# EAGLE design InterfaceBoardRevD (EAGLE 7.5.0)
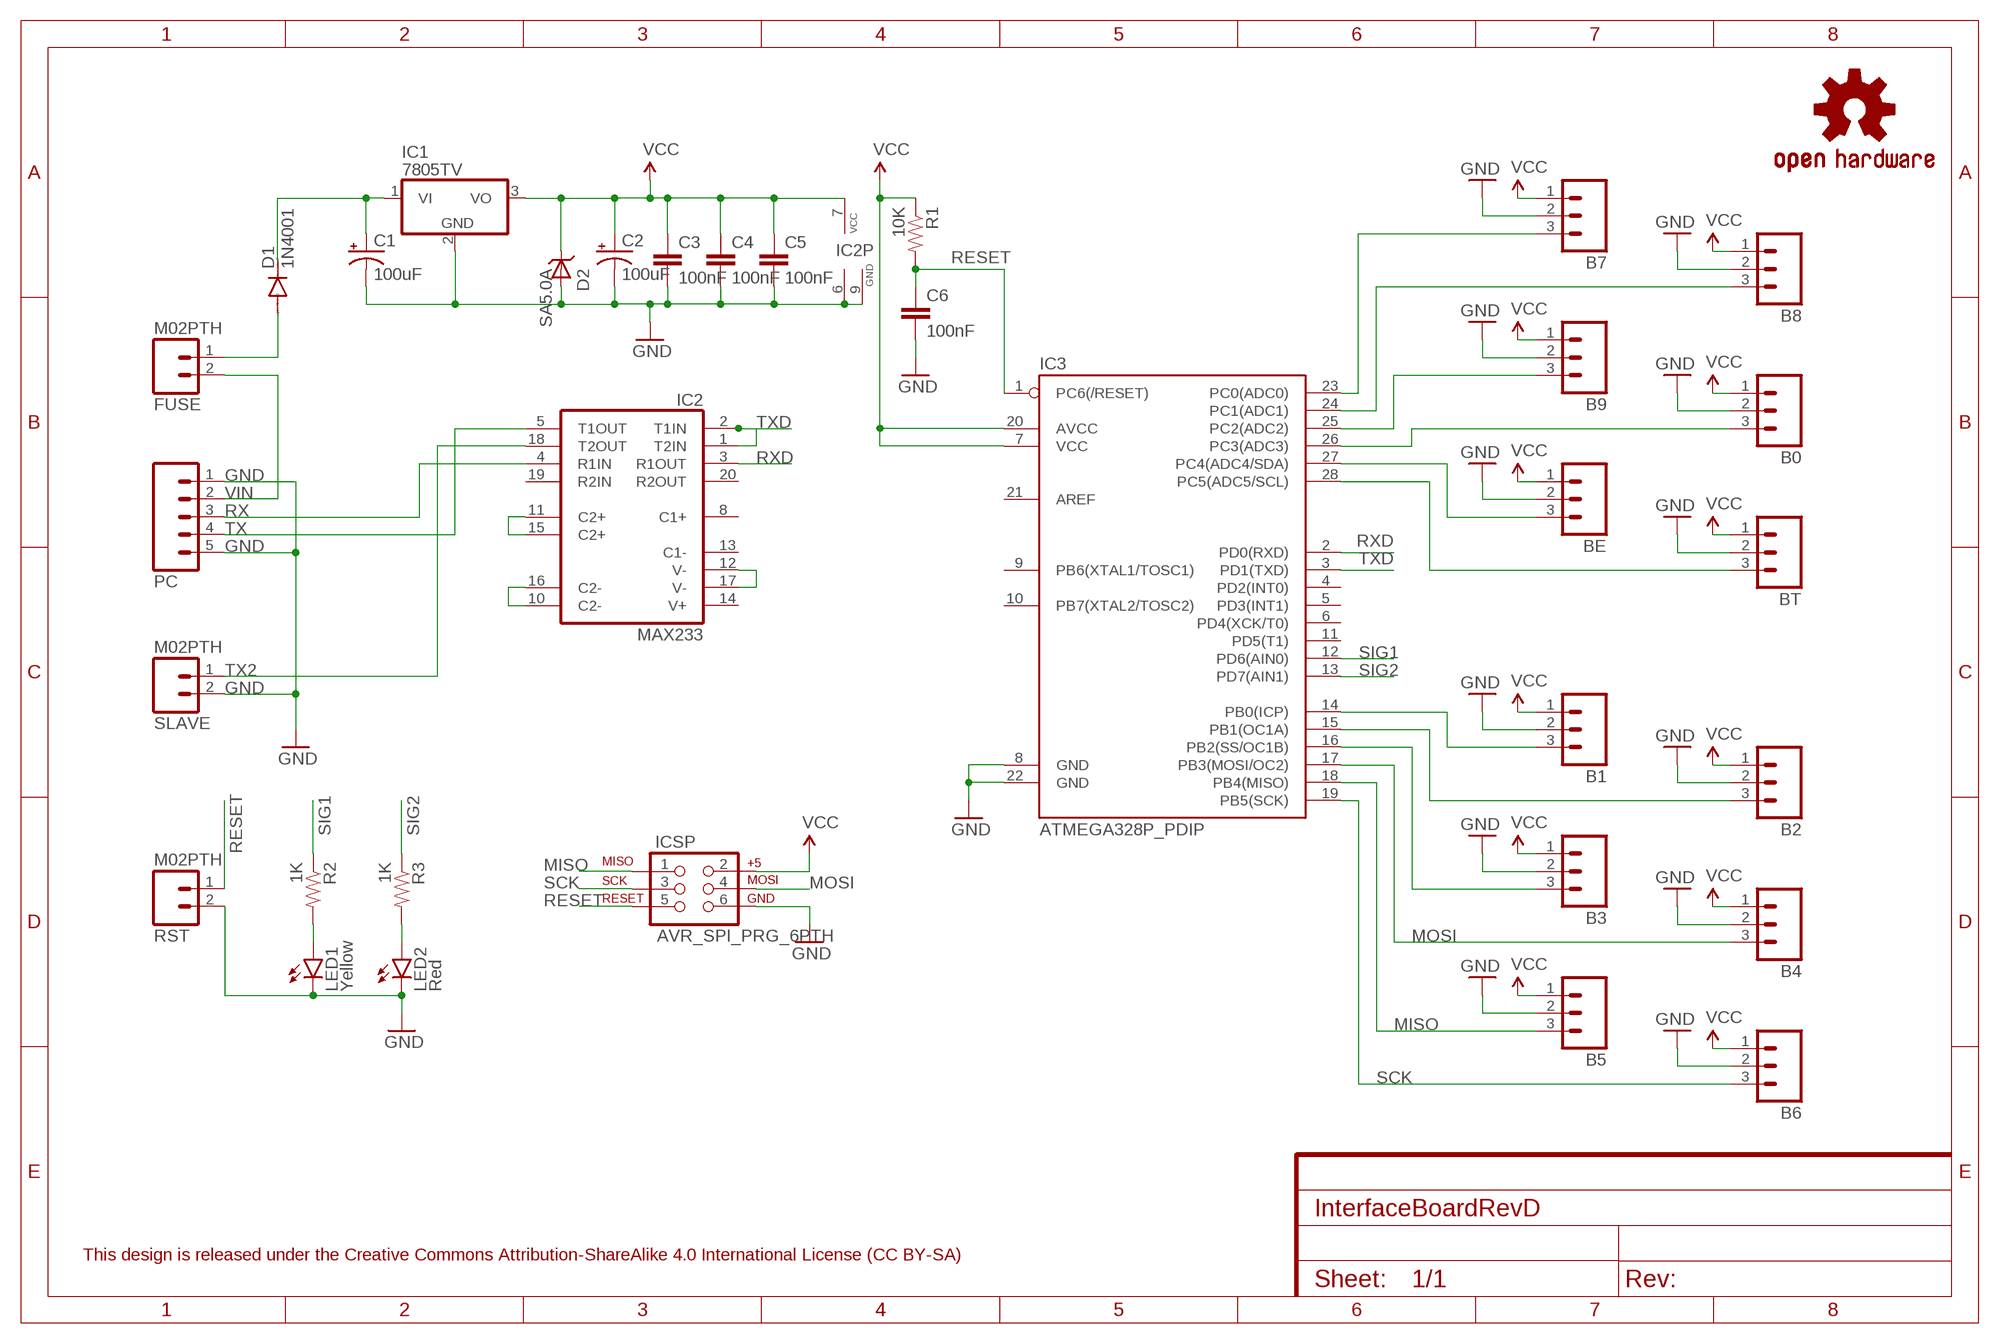
[diagram p0: schematic, sheet 1]
FRAME1 (FRAME-A4L): CNAME: Simulator Interface Board; CREVISION: D 08/2016; DESIGNER: A J Instone-Cowie

## Parts
B0  M03PTH  [1X03]
B1  M03PTH  [1X03]
B2  M03PTH  [1X03]
B3  M03PTH  [1X03]
B4  M03PTH  [1X03]
B5  M03PTH  [1X03]
B6  M03PTH  [1X03]
B7  M03PTH  [1X03]
B8  M03PTH  [1X03]
B9  M03PTH  [1X03]
BE  M03PTH  [1X03]
BT  M03PTH  [1X03]
C1  100uF  CAP_POLPTH1  [CPOL-RADIAL-100UF-25V]
C2  100uF  CAP_POLPTH1  [CPOL-RADIAL-100UF-25V]
C3  100nF  CAPPTH  [CAP-PTH-SMALL]
C4  100nF  CAPPTH  [CAP-PTH-SMALL]
C5  100nF  CAPPTH  [CAP-PTH-SMALL]
C6  100nF  CAPPTH  [CAP-PTH-SMALL]
D1  1N4001  [DO41_DIODE]
D2  SA5.0A  [DO41_TVS_UNI]
FUSE  M02PTH  [1X02]
IC1  7805TV  [TO220V]
IC2  MAX233  [DIL20]
IC3  ATMEGA328P_PDIP  [DIL28-3]
ICSP  AVR_SPI_PRG_6PTH  [2X3]
LED1  Yellow  LED-LH3MM  [LED3MM_LARGEHOLES]
LED2  Red  LED-LH3MM  [LED3MM_LARGEHOLES]
LOGO1  OSHW-LOGOS  [OSHW-LOGO-S]
PC  M05PTH  [1X05]
R1  10K  RESISTORPTH-1/4W  [AXIAL-0.4]
R2  1K  RESISTORPTH-1/4W  [AXIAL-0.4]
R3  1K  RESISTORPTH-1/4W  [AXIAL-0.4]
RST  M02PTH  [1X02]
SLAVE  M02PTH  [1X02]

## Nets
GND: B0.2 B1.2 B2.2 B3.2 B4.2 B5.2 B6.2 B7.2 B8.2 B9.2 BE.2 BT.2 C1.2(-) C2.2(-) C3.2 C4.2 C5.2 C6.2 D2.ANODE IC1.2(GND) IC2.6(GND) IC2.9(GND) IC3.8(GND) IC3.22(GND) ICSP.6 LED1.K(C) LED2.K(C) PC.1 PC.5 RST.2 SLAVE.2
MISO: B5.3 IC3.18(PB4(MISO)) ICSP.1
MOSI: B4.3 IC3.17(PB3(MOSI/OC2)) ICSP.4
N$1: B7.3 IC3.23(PC0(ADC0))
N$2: B8.3 IC3.24(PC1(ADC1))
N$3: B9.3 IC3.25(PC2(ADC2))
N$4: B0.3 IC3.26(PC3(ADC3))
N$5: BT.3 IC3.28(PC5(ADC5/SCL))
N$6: BE.3 IC3.27(PC4(ADC4/SDA))
N$8: LED1.A R2.P$2
N$9: IC2.10(C2-) IC2.16(C2-)
N$10: B3.3 IC3.16(PB2(SS/OC1B))
N$11: B2.3 IC3.15(PB1(OC1A))
N$12: B1.3 IC3.14(PB0(ICP))
N$13: IC2.11(C2+) IC2.15(C2+)
N$14: IC2.12(V-) IC2.17(V-)
N$15: D1.A FUSE.1
N$16: LED2.A R3.P$2
N$26: C1.1(+) D1.C IC1.1(VI)
RESET: C6.1 IC3.1(PC6(/RESET)) ICSP.5 R1.P$2 RST.1
RX: IC2.4(R1IN) PC.3
RXD: IC2.3(R1OUT) IC3.2(PD0(RXD))
SCK: B6.3 IC3.19(PB5(SCK)) ICSP.3
SIG1: IC3.12(PD6(AIN0)) R2.P$1
SIG2: IC3.13(PD7(AIN1)) R3.P$1
TX: IC2.5(T1OUT) PC.4
TX2: IC2.18(T2OUT) SLAVE.1
TXD: IC2.1(T2IN) IC2.2(T1IN) IC3.3(PD1(TXD))
VCC: B0.1 B1.1 B2.1 B3.1 B4.1 B5.1 B6.1 B7.1 B8.1 B9.1 BE.1 BT.1 C2.1(+) C3.1 C4.1 C5.1 D2.CATHODE IC1.3(VO) IC2.7(VCC) IC3.7(VCC) IC3.20(AVCC) ICSP.2 R1.P$1
VIN: FUSE.2 PC.2
Unconnected: IC2.8(C1+) IC2.13(C1-) IC2.14(V+) IC2.19(R2IN) IC2.20(R2OUT) IC3.4(PD2(INT0)) IC3.5(PD3(INT1)) IC3.6(PD4(XCK/T0)) IC3.9(PB6(XTAL1/TOSC1)) IC3.10(PB7(XTAL2/TOSC2)) IC3.11(PD5(T1)) IC3.21(AREF)

## Notes on the sheet
- This design is released under the Creative Commons Attribution-ShareAlike 4.0 International License (CC BY-SA)

## Library data of the parts
B0 B1-B9 BE BT = SparkFun-Connectors:M03: Header 3 Standard 3-pin 0.1" header. Use with straight break away headers (SKU : PRT-00116), right angle break away headers (PRT-00553), swiss pins (PRT-00743), machine pins (PRT-00117), and female headers (PRT-00115). Molex polarized connector foot print use with SKU : PRT-08232 with associated crimp pins and housings.
C1 C2 = SparkFun-Passives:CAP_POL: Capacitor Polarized These are standard SMD and PTH capacitors. Normally 10uF, 47uF, and 100uF in electrolytic and tantalum varieties. Always verify the external diameter of the through hole cap, it varies with capacity, voltage, and manufacturer. The EIA devices should be standard.
C3-C6 = SparkFun-Capacitors:CAP: Capacitor Standard 0603 ceramic capacitor, and 0.1" leaded capacitor.
D1 = AIC_Custom:1N4001: DIODE general purpose rectifier, 1 A
D2 = AIC_Custom:SA5.0A: SA5.0CA TVS Uni-Directional Transient Voltage Suppressor. 5V, DO41 package
FUSE RST SLAVE = SparkFun-Connectors:M02: Standard 2-pin 0.1" header. Use with - straight break away headers ( PRT-00116) - right angle break away headers (PRT-00553) - swiss pins (PRT-00743) - machine pins (PRT-00117) - female headers (PRT-00115) Molex polarized connector foot print use with: PRT-08233 with associated crimp pins and housings. 2.54_SCREWTERM for use with PRT-10571. 3.5mm Screw Terminal footprints for PRT-08084 5mm Screw Terminal footprints for use with PRT-08432
IC1 = linear:78*: Positive VOLTAGE REGULATOR Source: http://cache.national.com/ds/LM/LM78L05.pdf http://www.fairchildsemi.com/ds/LM/LM7805.pdf
IC2 = maxim:MAX233: RS232 TRANSCEIVER; MPN: MAX233ACPP+G36; OC_FARNELL: 1593332; OC_NEWARK: 89K3459
IC3 = SparkFun-DigitalIC:ATMEGA328P_PDIP: uC used in the Arduino 32kb flash, 1k EEPROM, 2k SRAM This is the through-hole version of this chip.
ICSP = SparkFun-Connectors:AVR_SPI_PRG_6: AVR ISP 6 Pin This is the reduced ISP connector for AVR programming. Common on Arduino. This footprint will take up less PCB space and can be used with a 10-pin to 6-pin adapter such as SKU: BOB-08508 **Special note about "TEST_POINT" package. The stop mask is on the top side, so if you want your programming test points to be on the bottom of your board, make sure to place this package on the bottom side of the board. This also ensure that the orientation to program from the bottom side will be correct.
LED1 LED2 = AIC_Custom:LED-LH: LEDs Standard schematic elements and footprints for 5mm, 3mm, 1206, and 0603 sized LEDs. 5mm - Spark Fun Electronics SKU : COM-00529 (and others). Custom variant with larger (0.04") holes suitable for header pins as an alternative.
LOGO1 = SparkFun-Aesthetics:OSHW-LOGO: Open Source Hardware Logo This logo indicates the piece of hardware it is found on incorporates a OSHW license and/or adheres to the definition of open source hardware found here: http://freedomdefined.org/OSHW
PC = SparkFun-Connectors:M05: Header 5 Standard 5-pin 0.1" header. Use with straight break away headers (SKU : PRT-00116), right angle break away headers (PRT-00553), swiss pins (PRT-00743), machine pins (PRT-00117), and female headers (PRT-00115). Molex polarized connector foot print use with SKU : PRT-08230 with associated crimp pins and housings.
R1-R3 = SparkFun-Passives:RESISTOR: Resistor Basic schematic elements and footprints for 0603, 1206, and PTH resistors.

## Board
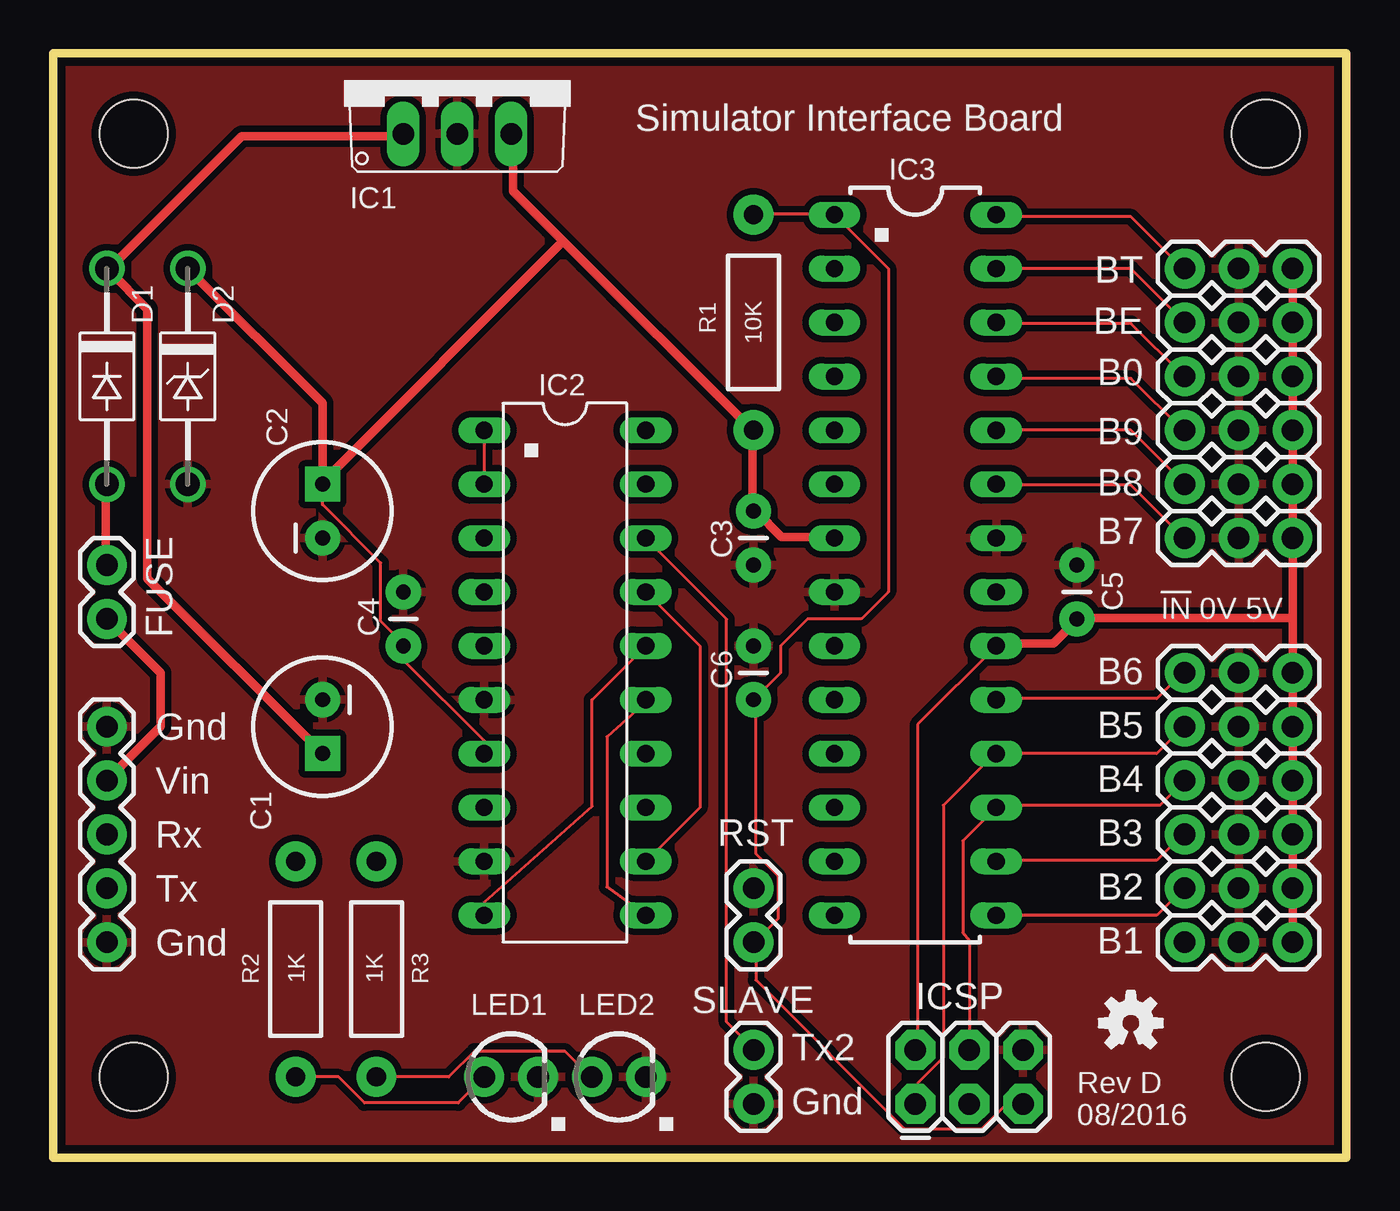
[diagram p1: board, top side]
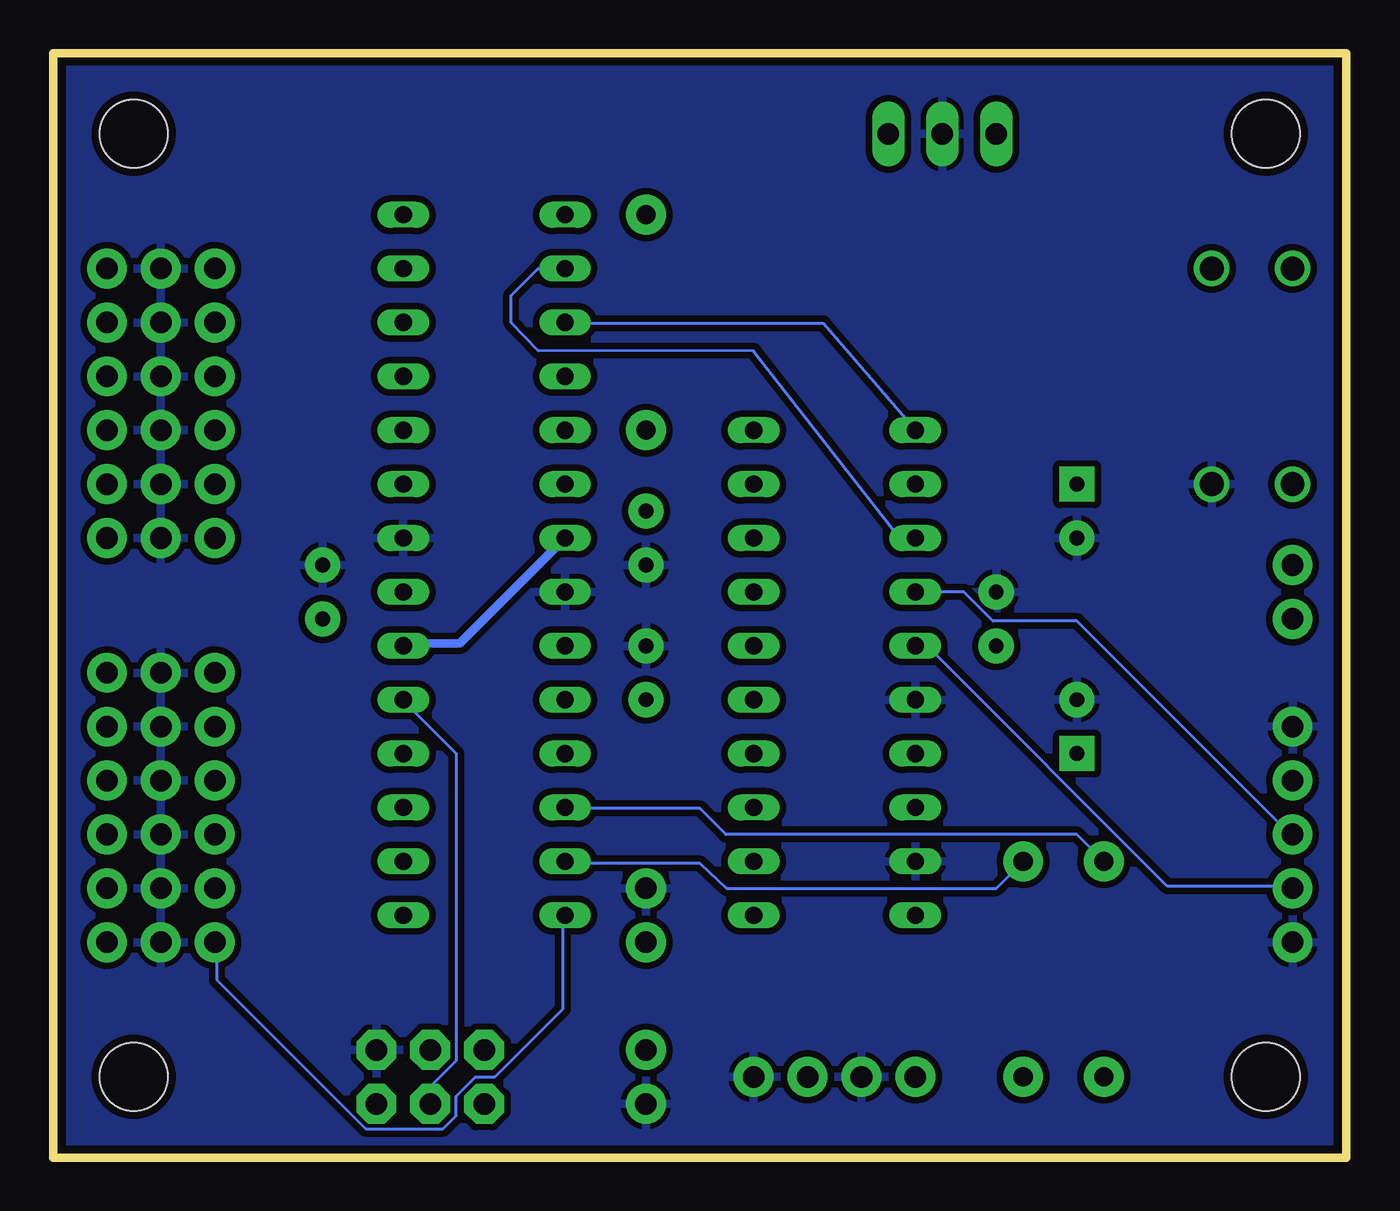
[diagram p2: board, bottom side, seen from below]

Size 60.96 x 52.07 mm. Coordinates in mm from the lower left corner, seen from the top.
Outline: 0,52.07 60.96,52.07 60.96,0 0,0 0,52.07
Copper layers (1*16): Top 0.0356mm / dielectric 1.5011mm / Bottom 0.0356mm
Design rules "LaenPCBOrder(OSHPARK)": minimum track width 6mil, minimum drill 13mil, track to track 6mil, track to pad 6mil, pad to pad 6mil, via to via 6mil, smd to smd 6mil, copper to edge 15mil, drill to drill 6mil, minimum pad ring 7mil, minimum via ring 7mil, stop-mask expansion 3mil, vias tented up to drill 0mil, thermal gap 10mil
Holes 3.2 mm at 57.15,3.81 57.15,48.26 3.81,3.81 3.81,48.26

### Footprints (pad centres in the part's own frame; a part is rotated, then mirrored left to right if it is on the bottom)
1X03 = drill 1.016 pad 1.88: 1 0,0; 2 2.54,0; 3 5.08,0
CPOL-RADIAL-100UF-25V = drill 0.7 pad 1.651 square: 1 1.27,0 | drill 0.7 pad 1.651: 2 -1.27,0
CAP-PTH-SMALL = drill 0.7 pad 1.651: 1 0,0; 2 2.54,0
DO41_DIODE = drill 1.118: A 5.08,0; C -5.08,0
DO41_TVS_UNI = drill 1.118: ANODE -5.08,0; CATHODE 5.08,0
1X02 = drill 1.016 pad 1.88: 1 0,0; 2 2.54,0
TO220V = drill 1.016 long: 1 -2.54,-2.54; 2 0,-2.54; 3 2.54,-2.54
DIL20 = drill 0.813 long: 1 -11.43,-3.81; 2 -8.89,-3.81; 3 -6.35,-3.81; 4 -3.81,-3.81; 5 -1.27,-3.81; 6 1.27,-3.81; 7 3.81,-3.81; 8 6.35,-3.81; 9 8.89,-3.81; 10 11.43,-3.81; 11 11.43,3.81; 12 8.89,3.81; 13 6.35,3.81; 14 3.81,3.81; 15 1.27,3.81; 16 -1.27,3.81; 17 -3.81,3.81; 18 -6.35,3.81; 19 -8.89,3.81; 20 -11.43,3.81
DIL28-3 = drill 0.813 long: 1 -16.51,-3.81; 2 -13.97,-3.81; 3 -11.43,-3.81; 4 -8.89,-3.81; 5 -6.35,-3.81; 6 -3.81,-3.81; 7 -1.27,-3.81; 8 1.27,-3.81; 9 3.81,-3.81; 10 6.35,-3.81; 11 8.89,-3.81; 12 11.43,-3.81; 13 13.97,-3.81; 14 16.51,-3.81; 15 16.51,3.81; 16 13.97,3.81; 17 11.43,3.81; 18 8.89,3.81; 19 6.35,3.81; 20 3.81,3.81; 21 1.27,3.81; 22 -1.27,3.81; 23 -3.81,3.81; 24 -6.35,3.81; 25 -8.89,3.81; 26 -11.43,3.81; 27 -13.97,3.81; 28 -16.51,3.81
2X3 = drill 1.016 pad 1.88 octagon: 1 0,0; 2 0,2.54; 3 2.54,0; 4 2.54,2.54; 5 5.08,0; 6 5.08,2.54
LED3MM_LARGEHOLES = drill 1.016 pad 1.88: A -1.27,0; K 1.27,0
1X05 = drill 1.016 pad 1.88: 1 0,0; 2 2.54,0; 3 5.08,0; 4 7.62,0; 5 10.16,0
AXIAL-0.4 = drill 0.9 pad 1.88: P$1 -5.08,0; P$2 5.08,0

### Placement (x,y rotation side)
B0  58.42,36.83 180 top
B1  58.42,10.16 180 top
B2  58.42,12.7 180 top
B3  58.42,15.24 180 top
B4  58.42,17.78 180 top
B5  58.42,20.32 180 top
B6  58.42,22.86 180 top
B7  58.42,29.21 180 top
B8  58.42,31.75 180 top
B9  58.42,34.29 180 top
BE  58.42,39.37 180 top
BT  58.42,41.91 180 top
C1  12.7,20.32 270 top
C2  12.7,30.48 90 top
C3  33.02,30.48 270 top
C4  16.51,24.13 90 top
C5  48.26,25.4 90 top
C6  33.02,21.59 90 top
D1  2.54,36.83 270 top
D2  6.35,36.83 90 top
FUSE  2.54,27.94 270 top
IC1  19.05,50.8 0 top
IC2  24.13,22.86 270 top
IC3  40.64,27.94 270 top
ICSP  40.64,2.54 0 top
LED1  21.59,3.81 0 top
LED2  26.67,3.81 0 top
LOGO1  50.8,6.35 0 top
PC  2.54,20.32 270 top
R1  33.02,39.37 90 top
R2  11.43,8.89 270 top
R3  15.24,8.89 270 top
RST  33.02,10.16 90 top
SLAVE  33.02,5.08 270 top

### Tracks (layer width: path | path; a pad name or v marks a point on that pad's centre or on a via)
GND
  pour Bottom (isolate 0.305): 0,52.07 0,0 60.96,0 60.96,52.07
  pour Top (isolate 0.305): 0,52.07 0,0 60.96,0 60.96,52.07
MISO
  Top 0.152: B5.3 53.24,20.27 52.02,19.05 IC3.18 44.4,19.05 41.96,16.61 41.96,4.72 40.74,3.5 40.74,2.59 ICSP.1
MOSI
  Top 0.152: B4.3 52.17,16.61 44.55,16.61 IC3.17 42.88,14.93 42.88,10.62 43.18,10.25 ICSP.4
N$1
  Top 0.152: IC3.23 44.55,31.7 50.8,31.7 53.24,29.26 B7.3
N$2
  Top 0.152: IC3.24 50.8,34.29 B8.3
N$3
  Top 0.152: IC3.25 44.55,36.73 50.8,36.73 53.24,34.29 B9.3
N$4
  Top 0.152: IC3.26 44.55,39.32 50.8,39.32 53.24,36.88 B0.3
N$5
  Top 0.152: IC3.28 44.55,44.35 50.8,44.35 53.24,41.91 BT.3
N$6
  Top 0.152: IC3.27 50.8,41.91 BE.3
N$8
  Top 0.152: R2.P$2 13.46,3.81 14.68,2.59 19.1,2.59 LED1.A
N$9
  Top 0.152: IC2.10 20.32,12.04 25.41,16.56 25.4,21.59 IC2.16 27.94,24.08
N$10
  Top 0.152: IC3.16 44.55,14.02 52.02,14.02 53.24,15.24 B3.3
N$11
  Top 0.152: IC3.15 52.02,11.43 53.24,12.65 B2.3
N$12
  Bottom 0.152: IC3.14 36.93,11.43 36.93,7.01 40.13,3.81 41.05,3.81 41.96,2.9 41.96,1.98 42.57,1.37 46.23,1.37 53.24,8.38 53.24,10.06 B1.3
N$13
  Top 0.152: IC2.15 27.94,21.49 26.1,19.84 26.1,12.76 IC2.11
N$14
  Top 0.152: IC2.17 30.48,24.13 30.48,16.51 IC2.12
N$15
  Top 0.152: 2.49,31.7 D1.A | 2.49,28.04 FUSE.1
  Top 0.406: 2.49,28.04 2.49,31.7
N$16
  Top 0.152: R3.P$2 18.64,3.81 19.86,5.03 24.13,5.03 25.35,3.81 LED2.A
N$26
  Top 0.152: 16.51,48.16 IC1.1 | 2.64,41.91 D1.C
  Top 0.406: 16.51,48.16 8.89,48.16 2.64,41.91 2.64,41.81 4.45,40 4.45,27.3 C1.1
RESET
  Top 0.152: R1.P$2 33.12,44.5 36.78,44.5 IC3.1 39.37,41.91 39.37,26.67 38.1,25.4 35.56,25.4 34.29,24.13 34.29,22.86 C6.1 | C6.1 33.12,21.49 33.12,14.33 34.19,13.26 34.19,11.28 33.12,10.21 RST.1 33.12,10.06 33.12,8.38 40.13,1.37 43.79,1.37 44.86,2.44 45.62,2.44 ICSP.5 | 33.12,22.25 33.12,21.64 C6.1
RX
  Bottom 0.152: IC2.4 18.03,26.67 16.66,25.3 12.7,25.3 2.64,15.24 PC.3
RXD
  Bottom 0.152: IC2.3 20.32,29.26 21.08,29.26 27.94,38.02 38.1,38.04 39.37,39.37 39.37,40.64 38.1,41.91 IC3.2 36.93,41.91
SCK
  Top 0.152: IC3.19 44.55,21.64 52.02,21.64 53.24,22.86 B6.3
  Bottom 0.152: ICSP.3 43.18,3.35 41.96,4.57 41.96,19.05 44.4,21.49 IC3.19
SIG1
  Bottom 0.152: R2.P$1 12.7,15.24 29.25,15.24 30.47,16.46 36.78,16.46 IC3.12
SIG2
  Bottom 0.152: IC3.13 36.78,13.87 30.47,13.87 29.21,12.7 16.51,12.7 R3.P$1
TX
  Bottom 0.152: IC2.5 20.32,24.08 19.71,24.08 8.43,12.8 2.64,12.8 PC.4
TX2
  Top 0.152: SLAVE.1 32.97,5.18 31.75,6.4 31.75,25.39 27.94,29.2 IC2.18
TXD
  Top 0.152: IC2.1 IC2.2
  Bottom 0.152: IC2.1 24.65,39.32 36.78,39.32 IC3.3
VCC
  Top 0.152: 44.55,24.23 IC3.20 40.74,20.42 40.74,5.18 ICSP.2 | 48.21,25.3 C5.1 48.36,25.45 | IC2.7 20.32,19.66 16.51,23.47 C4.1 16.51,24.23 15.44,25.3 15.44,28.04 12.7,30.78 12.7,31.7 C2.1 12.7,31.85 | 36.78,29.26 IC3.7 | 33.12,30.48 C3.1 32.97,30.48 | 21.69,48.16 IC1.3 | 32.97,34.29 R1.P$1 | 23.98,43.28 23.98,43.13
  Top 0.406: B1.1 B2.1 B3.1 B4.1 B5.1 B6.1 58.42,25.45 | BT.1 BE.1 B0.1 B9.1 B8.1 B7.1 58.42,25.45 | 44.55,24.23 47.14,24.23 48.21,25.3 | 36.78,29.26 34.34,29.26 33.12,30.48 | 21.69,48.16 21.69,45.57 23.98,43.28 32.97,34.29 32.97,30.48 | 23.98,43.13 12.7,31.85 | 48.36,25.45 58.42,25.45 | 12.7,31.7 12.7,35.56 D2.CATHODE
  Bottom 0.152: 44.4,24.23 IC3.20
  Bottom 0.406: 44.4,24.23 41.81,24.23 IC3.7
VIN
  Top 0.406: FUSE.2 5.08,22.86 5.08,20.32 PC.2

### Text on the board
tPlace: Simulator Interface Board | !IN! 0V 5V | Gnd / Vin / Rx / Tx / Gnd | Tx2 / Gnd | Rev D / 08/2016